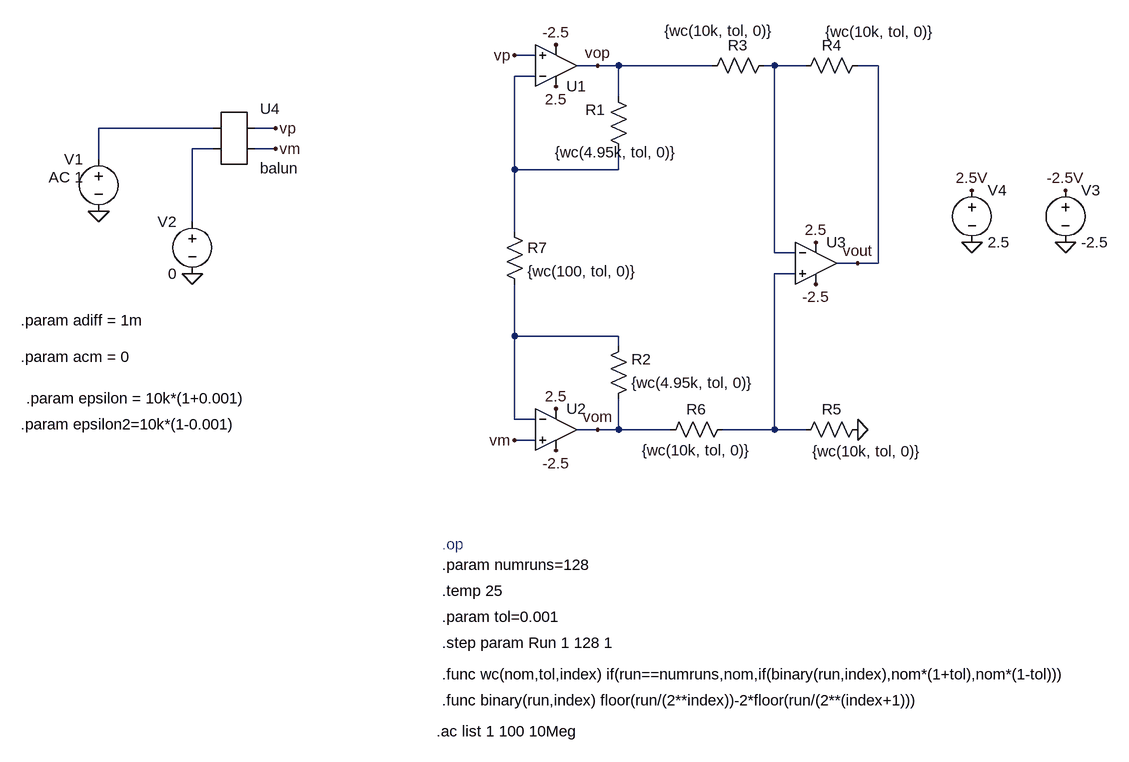
[diagram p0: schematic inamp_testbench_wc_ac.asc]
inamp_testbench_wc_ac.asc, the LTspice schematic file:
Version 4
SHEET 1 880 688
WIRE -176 -368 -208 -368
WIRE -80 -352 -112 -352
WIRE -48 -352 -80 -352
WIRE 96 -352 -48 -352
WIRE 192 -352 176 -352
WIRE 240 -352 192 -352
WIRE 352 -352 320 -352
WIRE -176 -336 -208 -336
WIRE -48 -304 -48 -352
WIRE -672 -256 -848 -256
WIRE -576 -256 -608 -256
WIRE -672 -224 -704 -224
WIRE -576 -224 -608 -224
WIRE -848 -208 -848 -256
WIRE -208 -192 -208 -336
WIRE -48 -192 -48 -224
WIRE -48 -192 -208 -192
WIRE -704 -112 -704 -224
WIRE -208 -96 -208 -192
WIRE 192 -64 192 -352
WIRE 224 -64 192 -64
WIRE 320 -48 288 -48
WIRE 352 -48 352 -352
WIRE 352 -48 320 -48
WIRE 224 -32 192 -32
WIRE -208 64 -208 -16
WIRE -48 64 -208 64
WIRE -48 80 -48 64
WIRE -208 192 -208 64
WIRE -176 192 -208 192
WIRE -80 208 -112 208
WIRE -48 208 -48 160
WIRE -48 208 -80 208
WIRE 32 208 -48 208
WIRE 192 208 192 -32
WIRE 192 208 112 208
WIRE 240 208 192 208
WIRE -176 224 -208 224
FLAG -144 -320 2.5
FLAG -144 -384 -2.5
FLAG -144 176 2.5
FLAG -144 240 -2.5
FLAG -80 -352 vop
FLAG -80 208 vom
FLAG 320 208 0
FLAG 256 -80 2.5
FLAG 256 -16 -2.5
FLAG 320 -48 vout
FLAG -208 -368 vp
FLAG -208 224 vm
FLAG 640 -80 0
FLAG 496 -80 0
FLAG 496 -160 2.5V
FLAG 640 -160 -2.5V
FLAG -848 -128 0
FLAG -576 -256 vp
FLAG -576 -224 vm
FLAG -704 -32 0
DATAFLAG -192 -368 ""
DATAFLAG -48 -352 ""
DATAFLAG 192 -352 ""
DATAFLAG 192 208 ""
DATAFLAG -48 208 ""
DATAFLAG -208 64 ""
DATAFLAG -208 -192 ""
DATAFLAG -208 224 ""
DATAFLAG 352 -48 ""
SYMBOL Opamps\\UniversalOpamp2 -144 -352 M180
SYMATTR InstName U1
SYMATTR SpiceModel level.1
SYMATTR Value2 Avol=10Meg GBW=1Meg Slew=10Meg
SYMBOL res -32 -208 R180
WINDOW 0 36 76 Left 2
WINDOW 3 -74 11 Left 2
SYMATTR InstName R1
SYMATTR Value {wc(4.95k, tol, 0)}
SYMATTR SpiceLine tol=0.1
SYMBOL Opamps\\UniversalOpamp2 -144 208 R0
SYMATTR InstName U2
SYMATTR SpiceModel level.1
SYMATTR Value2 Avol=10Meg GBW=1Meg Slew=10Meg
SYMBOL res -64 176 M180
WINDOW 0 36 76 Left 2
WINDOW 3 36 40 Left 2
SYMATTR InstName R2
SYMATTR Value {wc(4.95k, tol, 0)}
SYMBOL Opamps\\UniversalOpamp2 256 -48 R0
SYMATTR InstName U3
SYMATTR SpiceModel level.1
SYMATTR Value2 Avol=10Meg GBW=100Meg Slew=10Meg
SYMBOL res 192 -368 R90
WINDOW 0 0 56 VBottom 2
WINDOW 3 -53 86 VTop 2
SYMATTR InstName R3
SYMATTR Value {wc(10k, tol, 0)}
SYMATTR SpiceLine tol=0.1
SYMBOL res 336 -368 R90
WINDOW 0 0 56 VBottom 2
WINDOW 3 -52 -18 VTop 2
SYMATTR InstName R4
SYMATTR Value {wc(10k, tol, 0)}
SYMATTR SpiceLine tol=0.1
SYMBOL res 336 192 R90
WINDOW 0 0 56 VBottom 2
WINDOW 3 34 2 VTop 2
SYMATTR InstName R5
SYMATTR Value {wc(10k, tol, 0)}
SYMATTR SpiceLine tol=0.1
SYMBOL res 16 224 R270
WINDOW 0 32 56 VTop 2
WINDOW 3 0 56 VBottom 2
SYMATTR InstName R6
SYMATTR Value {wc(10k, tol, 0)}
SYMATTR SpiceLine tol=0.1
SYMBOL res -224 -112 R0
SYMATTR InstName R7
SYMATTR Value {wc(100, tol, 0)}
SYMATTR SpiceLine tol=0.1
SYMBOL voltage 640 -176 R0
WINDOW 123 0 0 Left 0
WINDOW 39 0 0 Left 0
SYMATTR InstName V3
SYMATTR Value -2.5
SYMBOL voltage 496 -176 R0
WINDOW 123 0 0 Left 0
WINDOW 39 0 0 Left 0
SYMATTR InstName V4
SYMATTR Value 2.5
SYMBOL AutoGenerated\\balun -640 -240 R0
SYMATTR InstName U4
SYMBOL voltage -848 -224 M0
WINDOW 123 24 44 Left 2
WINDOW 39 0 0 Left 0
SYMATTR Value2 AC 1
SYMATTR InstName V1
SYMATTR Value ""
SYMBOL voltage -704 -128 M0
WINDOW 123 24 124 Left 2
WINDOW 39 0 0 Left 0
SYMATTR InstName V2
SYMATTR Value 0
TEXT -320 384 Left 2 ;.op
TEXT -320 456 Left 2 !.temp 25
TEXT -320 496 Left 2 !.param tol=0.001
TEXT -320 536 Left 2 !.step param Run 1 128 1
TEXT -320 584 Left 2 !.func wc(nom,tol,index) if(run==numruns,nom,if(binary(run,index),nom*(1+tol),nom*(1-tol)))
TEXT -320 624 Left 2 !.func binary(run,index) floor(run/(2**index))-2*floor(run/(2**(index+1)))
TEXT -320 416 Left 2 !.param numruns=128
TEXT -328 672 Left 2 !.ac list 1 100 10Meg
TEXT -968 40 Left 2 !.param adiff = 1m
TEXT -968 96 Left 2 !.param acm = 0
TEXT -960 160 Left 2 !.param epsilon = 10k*(1+0.001)
TEXT -968 200 Left 2 !.param epsilon2=10k*(1-0.001)

The netlist it stands for:
* inamp_testbench_wc_ac.asc
XU1 vp N002 2.5 -2.5 vop level.1 Avol=10Meg GBW=1Meg Slew=10Meg ilimit=25m rail=0 Vos=0 phimargin=45 en=0 enk=0 in=0 ink=0 Rin=500Meg  ; pins IN+ IN- V+ V- OUT
R1 N002 vop {wc(4.95k, tol, 0)} tol=0.1
XU2 vm N006 2.5 -2.5 vom level.1 Avol=10Meg GBW=1Meg Slew=10Meg ilimit=25m rail=0 Vos=0 phimargin=45 en=0 enk=0 in=0 ink=0 Rin=500Meg  ; pins IN+ IN- V+ V- OUT
R2 vom N006 {wc(4.95k, tol, 0)}
XU3 N005 N001 2.5 -2.5 vout level.1 Avol=10Meg GBW=100Meg Slew=10Meg ilimit=25m rail=0 Vos=0 phimargin=45 en=0 enk=0 in=0 ink=0 Rin=500Meg  ; pins IN+ IN- V+ V- OUT
R3 N001 vop {wc(10k, tol, 0)} tol=0.1
R4 vout N001 {wc(10k, tol, 0)} tol=0.1
R5 0 N005 {wc(10k, tol, 0)} tol=0.1
R6 vom N005 {wc(10k, tol, 0)} tol=0.1
R7 N002 N006 {wc(100, tol, 0)} tol=0.1
V3 -2.5V 0 -2.5
V4 2.5V 0 2.5
* U4: balun (symbol AutoGenerated\balun not available, pins judged from their places): pin1=N003 pin2=N004 pin3=vp pin4=vm
V1 N003 0 AC 1
V2 N004 0 0
* .op
.temp 25
.param tol=0.001
.step param Run 1 128 1
.func wc(nom,tol,index) if(run==numruns,nom,if(binary(run,index),nom*(1+tol),nom*(1-tol)))
.func binary(run,index) floor(run/(2**index))-2*floor(run/(2**(index+1)))
.param numruns=128
.ac list 1 100 10Meg
.param adiff = 1m
.param acm = 0
.param epsilon = 10k*(1+0.001)
.param epsilon2=10k*(1-0.001)
.lib UniversalOpamps2.sub
.backanno
.end